# EAGLE design relayBoard (EAGLE 7.5.0)
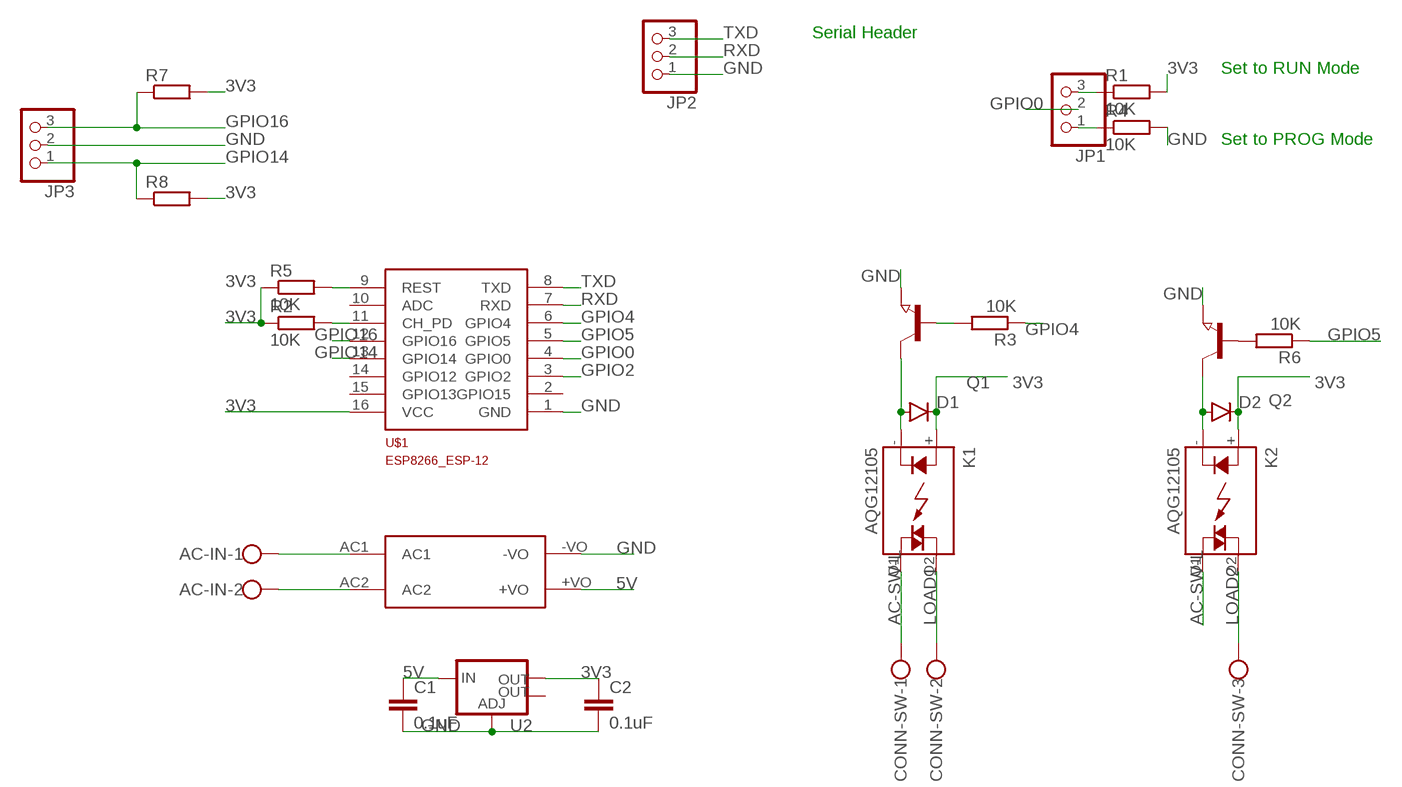
[diagram p0: schematic, sheet 1]

## Parts
AC-IN  W237-102  [W237-102]
C1  0.1uF  0.1UF-25V-5%(0603)  [0603-CAP]
C2  0.1uF  0.1UF-25V-5%(0603)  [0603-CAP]
CONN-SW  W237-103  [W237-103]
D1  DIODESMA  [SMA-DIODE]
D2  DIODESMA  [SMA-DIODE]
JP1  PINHD-1X3  [1X03]
JP2  PINHD-1X3  [1X03]
JP3  PINHD-1X3  [1X03]
K1  AQG12105  [AQG]
K2  AQG12105  [AQG]
Q1  NPN-TRANSISTOR_SOT23  [SOT23]
Q2  NPN-TRANSISTOR_SOT23  [SOT23]
R1  10K  R-EU_R0805  [R0805]
R2  10K  R-EU_R0805  [R0805]
R3  10K  R-EU_R0805  [R0805]
R4  10K  R-EU_R0805  [R0805]
R5  10K  R-EU_R0805  [R0805]
R6  10K  R-EU_R0805  [R0805]
R7  R-EU_R0805  [R0805]
R8  R-EU_R0805  [R0805]
U2  V_REG_LM1117SOT223  [SOT223]
U$1  ESP8266_ESP-12  [ESP8266-ESP12]
U$4  HLK-PM01  [HLK-PM01]

## Nets
3V3: C2.1 D1.C D2.C K1.+(A) K2.+(A) R1.2 R2.1 R5.1 R7.2 R8.2 U2.2(OUT) U$1.16(VCC)
5V: C1.1 U2.3(IN) U$4.+VO
AC-SW-L [ac]: CONN-SW.1 K1.O1(DS2) K2.O1(DS2)
CH_PD: R2.2 U$1.11(CH_PD)
GND: C1.2 C2.2 JP2.1 JP3.2 Q1.2(E) Q2.2(E) R4.2 U2.1(ADJ) U$1.1(GND) U$4.-VO
GPIO0: JP1.2 U$1.4(GPIO0)
GPIO2: U$1.3(GPIO2)
GPIO4: R3.1 U$1.6(GPIO4)
GPIO5: R6.1 U$1.5(GPIO5)
GPIO14: JP3.1 R8.1 U$1.13(GPIO14)
GPIO16: JP3.3 R7.1 U$1.12(GPIO16)
LOAD1 [ac]: CONN-SW.2 K1.O2(DS1)
LOAD2 [ac]: CONN-SW.3 K2.O2(DS1)
N$1: JP1.3 R1.1
N$2: AC-IN.1 U$4.AC1
N$3: JP1.1 R4.1
N$4: R5.2 U$1.9(REST)
N$5: AC-IN.2 U$4.AC2
N$7: D2.A K2.-(K) Q2.3(C)
N$8: Q2.1(B) R6.2
N$10: D1.A K1.-(K) Q1.3(C)
N$12: Q1.1(B) R3.2
RXD: JP2.2 U$1.7(RXD)
TXD: JP2.3 U$1.8(TXD)
Unconnected: U2.4(OUT) U$1.2(GPIO15) U$1.10(ADC) U$1.14(GPIO12) U$1.15(GPIO13)

## Notes on the sheet
- Serial Header
- Set to RUN Mode
- Set to PROG Mode

## Library data of the parts
AC-IN = con-wago-500:W237-102: WAGO SCREW CLAMP; MPN: 237-102; OC_FARNELL: unknown; OC_NEWARK: 70K9898
C1 C2 = SparkFun-Capacitors:0.1UF-25V-5%(0603): CAP-08604; PROD_ID: CAP-08604
CONN-SW = con-wago-500:W237-103: WAGO SCREW CLAMP; MPN: 237-103; OC_FARNELL: unknown; OC_NEWARK: 18M7116
D1 D2 = SparkFun-DiscreteSemi:DIODE: Diode These are standard reverse protection diodes and small signal diodes. SMA package can handle up to about 1A. SOD-323 can handle about 200mA. What the SOD-323 package when ordering, there are some mfgs out there that are 5-pin packages.
JP1-JP3 = pinhead:PINHD-1X3: PIN HEADER
K1 K2 = relay:AQG*: SOLID STATE RELAY NAiS Zero-cross, Non zero-cross Source: http://www.mew-europe.com/.. en_ds_61611_0000.pdf; MF: AROMAT/ MATSUSHITA; MPN: AQG12105; OC_FARNELL: unknown; OC_NEWARK: 20J4759
Q1 Q2 = semicon-smd-ipc:NPN-TRANSISTOR_: NPN TRANSISTOR
R1-R8 = resistor:R-EU_: RESISTOR, European symbol
U2 = SparkFun-PowerIC:V_REG_LM1117: Voltage Regulator LM1117 Standard adjustable voltage regulator but in SMD form. Spark Fun Electronics SKU : COM-00595; PROD_ID: VREG-08170
U$1 = ESP8266-ESP12:ESP8266_ESP-12: ESP8266 ESP-12 Discussion about pins here: http://www.esp8266.com/viewtopic.php?f=13&t=1429
U$4 = hlk-pm01:HLK-PM01

## Net classes
0 default: width 0.152 mm, drill 0.305 mm, clearance 0.152 mm
1 ac: width 1.27 mm, drill 1.27 mm, clearance 2.54 mm

## Board
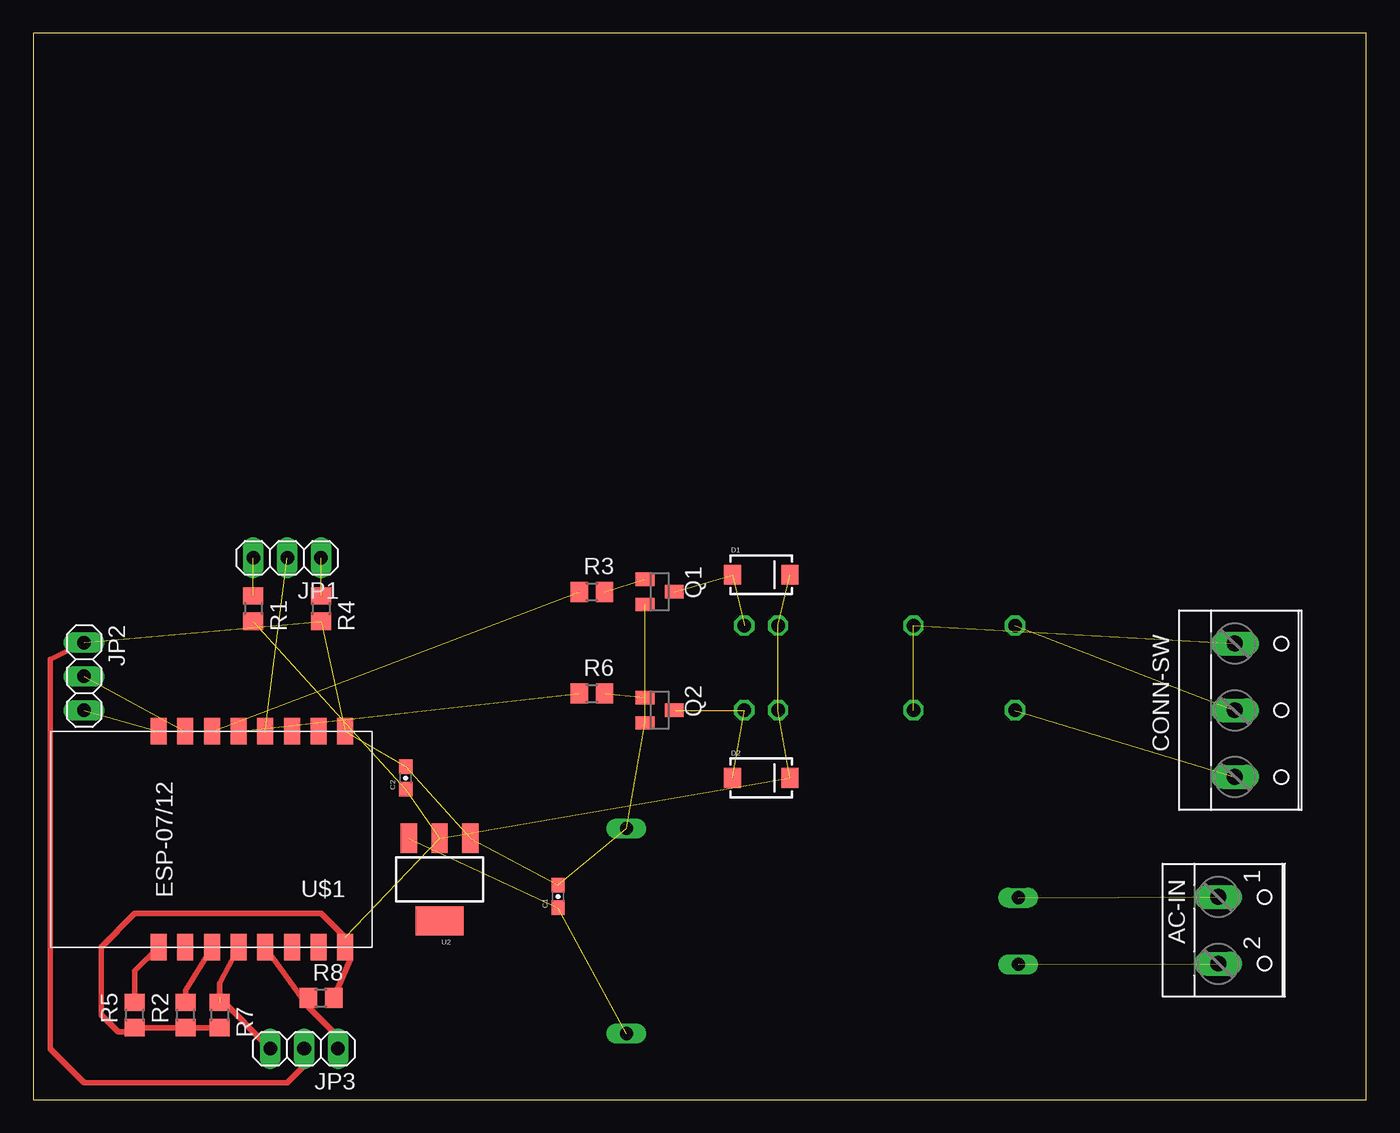
[diagram p1: board, top side]
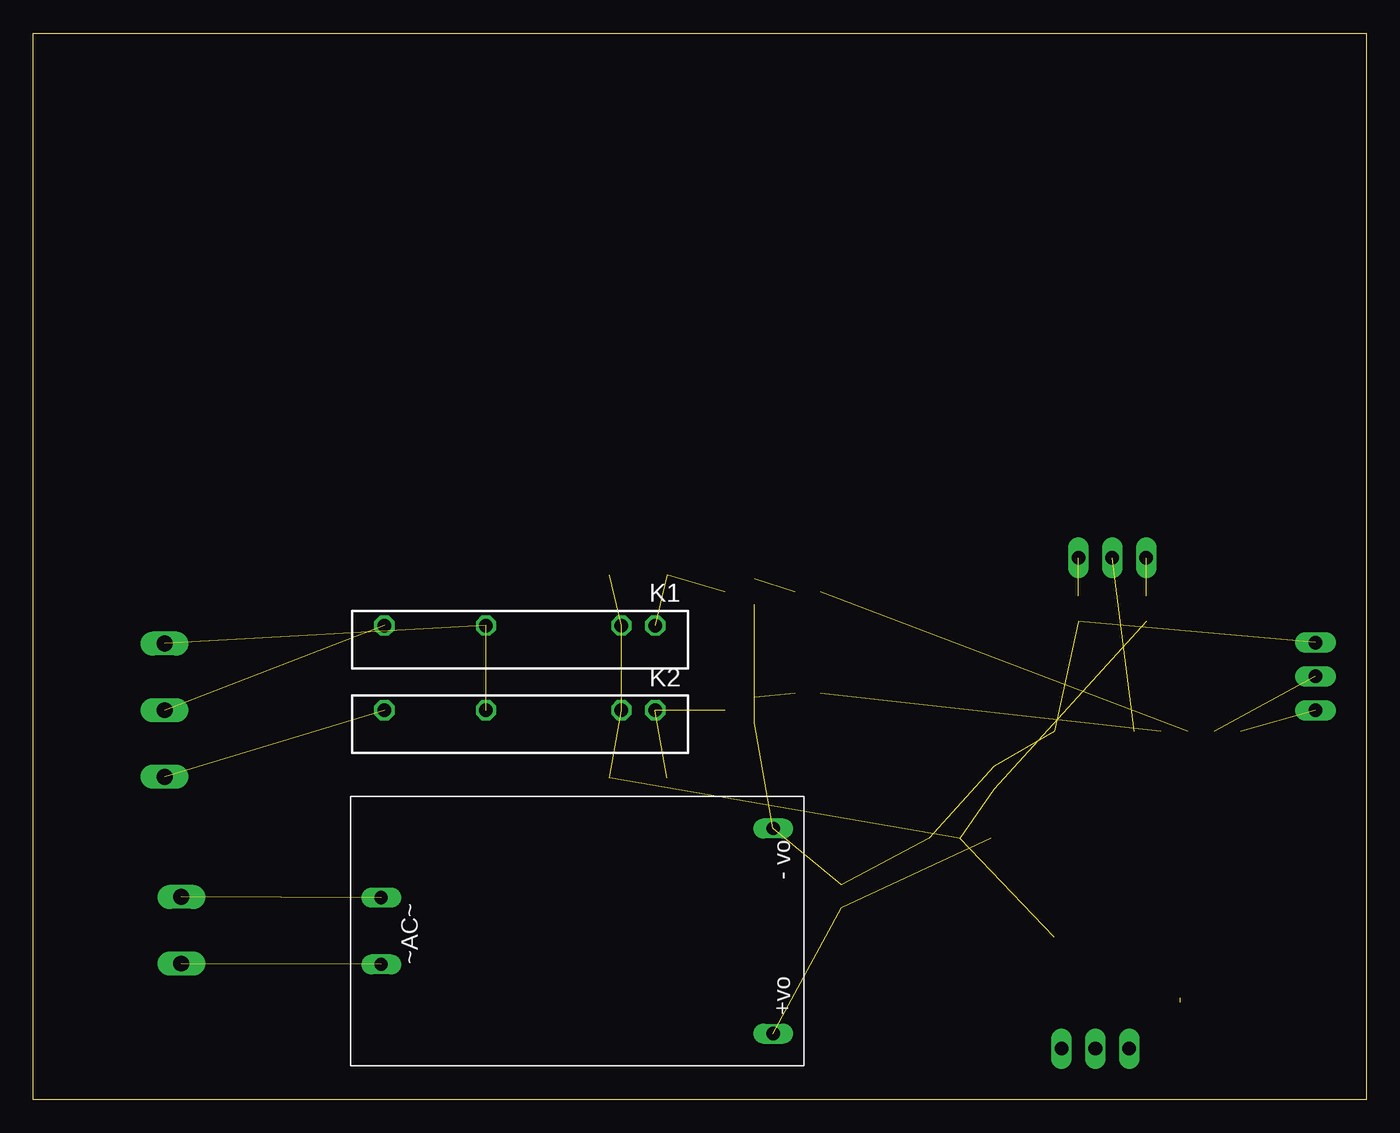
[diagram p2: board, bottom side, seen from below]

Size 100 x 80 mm. Coordinates in mm from the lower left corner, seen from the top.
Outline: 0,0 100,0 100,80 0,80 0,0
Copper layers (1*16): Top 0.035mm / dielectric 1.5mm / Bottom 0.035mm
Design rules "default": minimum track width 10mil, minimum drill 24mil, track to track 8mil, track to pad 8mil, pad to pad 8mil, via to via 8mil, smd to smd 8mil, copper to edge 40mil, drill to drill 8mil, minimum pad ring 10mil, minimum via ring 8mil, stop-mask expansion 4mil, vias tented up to drill 0mil, thermal gap 10mil

### Footprints (pad centres in the part's own frame; a part is rotated, then mirrored left to right if it is on the bottom)
W237-102 = drill 1.194 long: 1 -2.5,-1.27; 2 2.5,-1.27
0603-CAP = smd 1.1 x 1: 1 -0.85,0; 2 0.85,0
W237-103 = drill 1.194 long: 1 -5,-1.29; 2 0,-1.29; 3 5,-1.29
SMA-DIODE = smd 1.27 x 1.47: A -2.15,0; C 2.15,0
1X03 = drill 1.016 long: 1 -2.54,0; 2 0,0; 3 2.54,0
AQG = drill 1 octagon: + -7.62,0; - -10.16,0; O1 2.54,0; O2 10.16,0
SOT23 = smd 1 x 1.4: 1 -0.95,-1.1; 2 0.95,-1.1; 3 0,1.1
R0805 = smd 1.3 x 1.5: 1 -0.95,0; 2 0.95,0
SOT223 = smd 1.219 x 2.235: 1 -2.311,-3.099; 2 0,-3.099; 3 2.311,-3.099 | smd 3.6 x 2.2: 4 0,3.099
ESP8266-ESP12 = smd 2 x 1.2: 1 16.2,2; 2 16.2,4; 3 16.2,6; 4 16.2,8; 5 16.2,10; 6 16.2,12; 7 16.2,14; 8 16.2,16; 9 0,16; 10 0,14; 11 0,12; 12 0,10; 13 0,8; 14 0,6; 15 0,4; 16 0,2
HLK-PM01 = drill 1 long: +VO 31.7,2.4; -VO 31.7,17.8; AC1 2.3,12.6; AC2 2.3,7.6

### Placement (x,y rotation side)
AC-IN  90.17,12.7 270 top
C1  39.37,15.24 90 top
C2  27.94,24.13 90 top
CONN-SW  91.44,29.21 270 top
D1  54.61,39.37 0 top
D2  54.61,24.13 0 top
JP1  19.05,40.64 180 top
JP2  3.81,31.75 270 top
JP3  20.32,3.81 180 top
K1  63.5,35.56 180 bottom
K2  63.5,29.21 180 bottom
Q1  46.99,38.1 270 top
Q2  46.99,29.21 270 top
R1  16.51,36.83 270 top
R2  11.43,6.35 90 top
R3  41.91,38.1 0 top
R4  21.59,36.83 270 top
R5  7.62,6.35 90 top
R6  41.91,30.48 0 top
R7  13.97,6.35 270 top
R8  21.59,7.62 0 top
U2  30.48,16.51 180 top
U$1  25.4,11.43 90 top
U$4  76.2,2.54 0 bottom

### Tracks (layer width: path | path; a pad name or v marks a point on that pad's centre or on a via)
3V3  (7 unrouted)
  Top 0.406: R7.2 R2.1 R5.1 7.3,5.08 6.35,5.08 5.08,6.35 5.08,11.43 7.62,13.97 21.59,13.97 23.4,12.16 U$1.16 23.81,10.57 R8.2
5V  (2 unrouted)
AC-SW-L  (2 unrouted)
CH_PD
  Top 0.406: R2.2 11.43,8.19 U$1.11
GND  (8 unrouted)
  Top 0.406: JP3.2 20.32,2.54 19.05,1.27 3.81,1.27 1.27,3.81 1.27,33.02 JP2.1
GPIO0  (1 unrouted)
GPIO4  (1 unrouted)
GPIO5  (1 unrouted)
GPIO14
  Top 0.406: R8.1 20.64,6.92 | 20.64,6.92 U$1.13 | JP3.1 22.86,4.7 20.64,6.92
GPIO16  (1 unrouted)
  Top 0.406: R7.1 13.97,7.62 | 13.97,7.62 13.97,8.73 U$1.12 | JP3.3 13.97,7.62
LOAD1  (1 unrouted)
LOAD2  (1 unrouted)
N$1  (1 unrouted)
N$2  (1 unrouted)
N$3  (1 unrouted)
N$4
  Top 0.406: R5.2 7.62,9.65 U$1.9
N$5  (1 unrouted)
N$7  (2 unrouted)
N$8  (1 unrouted)
N$10  (2 unrouted)
N$12  (1 unrouted)
RXD  (1 unrouted)
TXD  (1 unrouted)